# Altium project flight-controller.PrjPCB
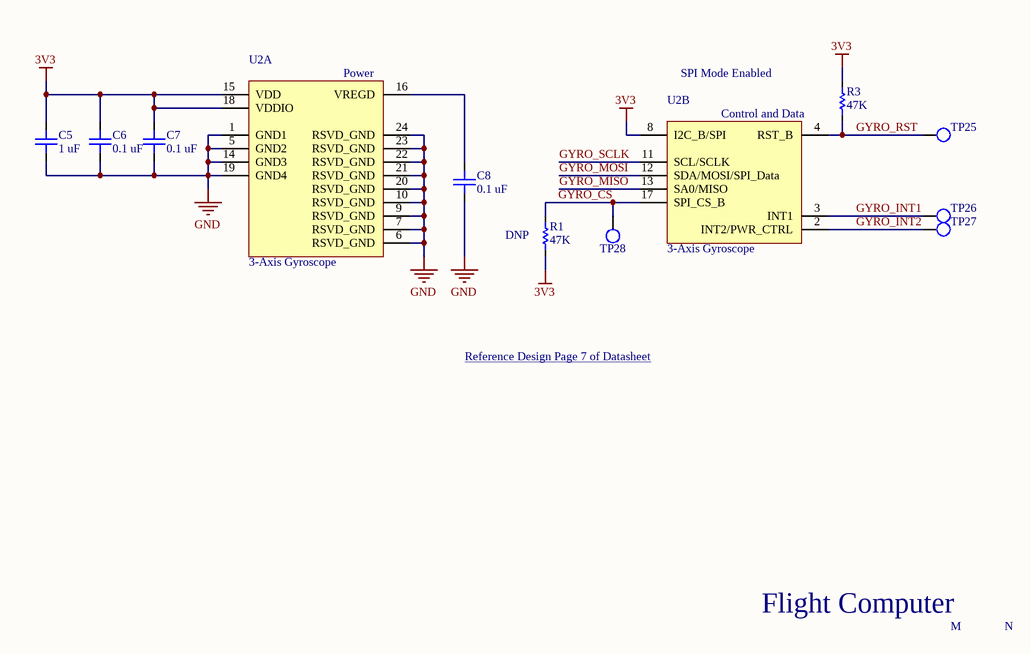
[diagram p0: gyro.SchDoc]
10 sheets, 149 parts. Net scope: global (net labels, ports and power ports of the same name join across sheets).
Board file: flight-controller.PcbDoc
Sheets:
  gyro.SchDoc
  accelerometer.SchDoc
  top_level.SchDoc
  mcu_power.SchDoc
  motor_control.SchDoc
  radio.SchDoc
  sensors.SchDoc
  programming.SchDoc
  power.SchDoc
  usb_serial.SchDoc

## Sheet gyro.SchDoc: Fault-Tolerant Quadcopter
size A; DrawnBy: Vaughn Kottler; Engineer: Vaughn Kottler; Revision: A

### Parts
C5  1 uF  [CAP-CER-0805-TALL]
C6  0.1 uF  [CAP-CER-0805-SHORT]
C7  0.1 uF  [CAP-CER-0805-SHORT]
C8  0.1 uF  [CAP-CER-0805-SHORT]
R1  47K  [RES-0805]
R3  47K  [RES-0805]
TP25  Test Point  [0603 Test Point]  (value not drawn)
TP26  Test Point  [0603 Test Point]  (value not drawn)
TP27  Test Point  [0603 Test Point]  (value not drawn)
TP28  Test Point  [0603 Test Point]  (value not drawn)
U2  3-Axis Gyroscope  [QFN24]  (parts A,B of 2)

### Nets
3V3: C5.2 C6.2 C7.2 R1.1 R3.2 U2.8(I2C_B/SPI) U2.15(VDD) U2.18(VDDIO)
GND: C5.1 C6.1 C7.1 C8.1 U2.1(GND1) U2.5(GND2) U2.6(RSVD_GND) U2.7(RSVD_GND) U2.9(RSVD_GND) U2.10(RSVD_GND) U2.14(GND3) U2.19(GND4) U2.20(RSVD_GND) U2.21(RSVD_GND) U2.22(RSVD_GND) U2.23(RSVD_GND) U2.24(RSVD_GND)
GYRO_CS: R1.2 TP28.1 U2.17(SPI_CS_B)
GYRO_INT1: TP26.1 U2.3(INT1)
GYRO_INT2: TP27.1 U2.2(INT2/PWR_CTRL)
GYRO_MISO: U2.13(SA0/MISO)
GYRO_MOSI: U2.12(SDA/MOSI/SPI_Data)
GYRO_RST: R3.1 TP25.1 U2.4(RST_B)
GYRO_SCLK: U2.11(SCL/SCLK)
NetC8_2: C8.2 U2.16(VREGD)

### Notes on the sheet
- SPI Mode Enabled
- (near R1) DNP
- Reference Design Page 7 of Datasheet <http://cache.freescale.com/files/sensors/doc/data_sheet/FXAS21002.pdf>
- Flight Computer
- M
- N
- (in symbol FXAS21002C, part A) Power
- (in symbol FXAS21002C, part B) Control and Data

### Library data of the parts
C5 = CAP-CER-1uF-10V: 10%, 0805; ComponentLink1Description: Capacitor Book (Amazon); ComponentLink1URL: https://www.amazon.com/gp/product/B0728HBDRW/
C6-C8 = CAP-CER-0.1uF-25V: 10%, 0805; ComponentLink1Description: Capacitor Book (Amazon); ComponentLink1URL: https://www.amazon.com/gp/product/B0728HBDRW/
R1 R3 = RES-47K-1/8W: 0805; ComponentLink1Description: Resistor Book (Amazon); ComponentLink1URL: https://www.amazon.com/gp/product/B071J21FYF/
TP25-TP28 = Test Point: 0603; Supplier 1: Digi-Key; Supplier Part Number 1: A106145DKR-ND
U2 = FXAS21002C: 3-Axis Digital Angular Rate Gyroscope; Supplier 1: Digi-Key; Supplier Part Number 1: FXAS21002CQR1CT-ND; ComponentLink1Description: Datasheet; ComponentLink1URL: http://cache.freescale.com/files/sensors/doc/data_sheet/FXAS21002.pdf

## Sheet accelerometer.SchDoc: Fault-Tolerant Quadcopter
size A; DrawnBy: Vaughn Kottler; Engineer: Vaughn Kottler; Revision: A
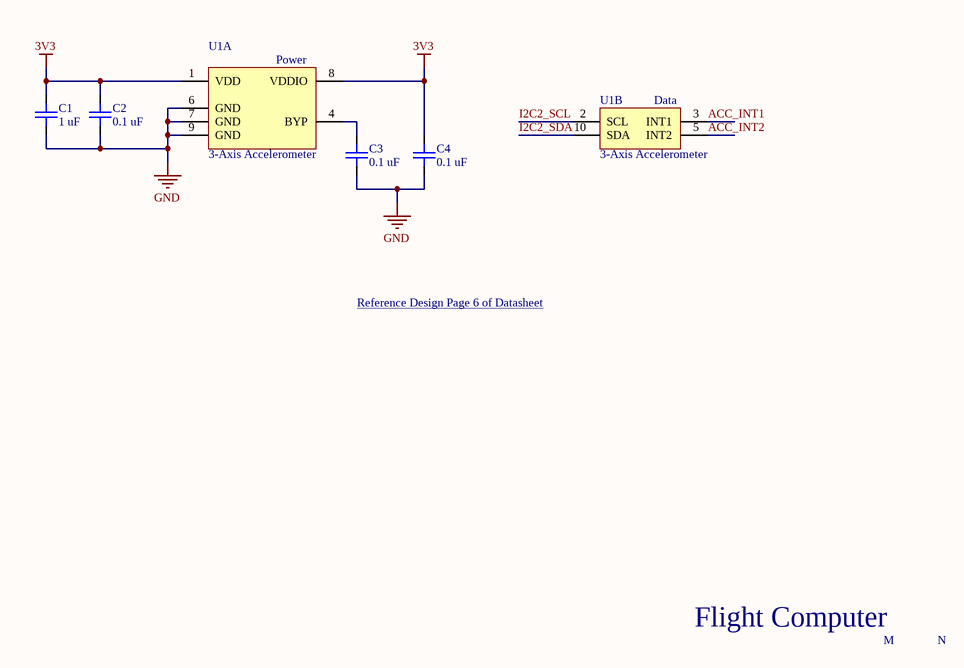
[diagram p1: accelerometer.SchDoc]

### Parts
C1  1 uF  [CAP-CER-0805-TALL]
C2  0.1 uF  [CAP-CER-0805-SHORT]
C3  0.1 uF  [CAP-CER-0805-SHORT]
C4  0.1 uF  [CAP-CER-0805-SHORT]
U1  3-Axis Accelerometer  [SON10]  (parts A,B of 2)

### Nets
3V3: C1.2 C2.2 C4.2 U1.1(VDD) U1.8(VDDIO)
GND: C1.1 C2.1 C3.1 C4.1 U1.6(GND) U1.7(GND) U1.9(GND)
ACC_INT1: U1.3(INT1)
ACC_INT2: U1.5(INT2)
I2C2_SCL: U1.2(SCL)
I2C2_SDA: U1.10(SDA)
NetC3_2: C3.2 U1.4(BYP)

### Notes on the sheet
- Reference Design Page 6 of Datasheet <https://media.digikey.com/pdf/Data%20Sheets/NXP%20PDFs/MMA8652FC.pdf>
- Flight Computer
- M
- N
- (in symbol MMA8652FC, part A) Power
- (in symbol MMA8652FC, part B) Data

### Library data of the parts
C1 = CAP-CER-1uF-10V: 10%, 0805; ComponentLink1Description: Capacitor Book (Amazon); ComponentLink1URL: https://www.amazon.com/gp/product/B0728HBDRW/
C2-C4 = CAP-CER-0.1uF-25V: 10%, 0805; ComponentLink1Description: Capacitor Book (Amazon); ComponentLink1URL: https://www.amazon.com/gp/product/B0728HBDRW/
U1 = MMA8652FC: 3-Axis, 12-bit Digital Accelerometer, I2C 400kHz; ComponentLink1Description: Datasheet; ComponentLink1URL: https://media.digikey.com/pdf/Data%20Sheets/NXP%20PDFs/MMA8652FC.pdf; Supplier 1: Digi-Key; Supplier Part Number 1: MMA8652FCR1DKR-ND

## Sheet top_level.SchDoc: Fault-Tolerant Quadcopter
size A; DrawnBy: Vaughn Kottler; Engineer: Vaughn Kottler; Revision: A
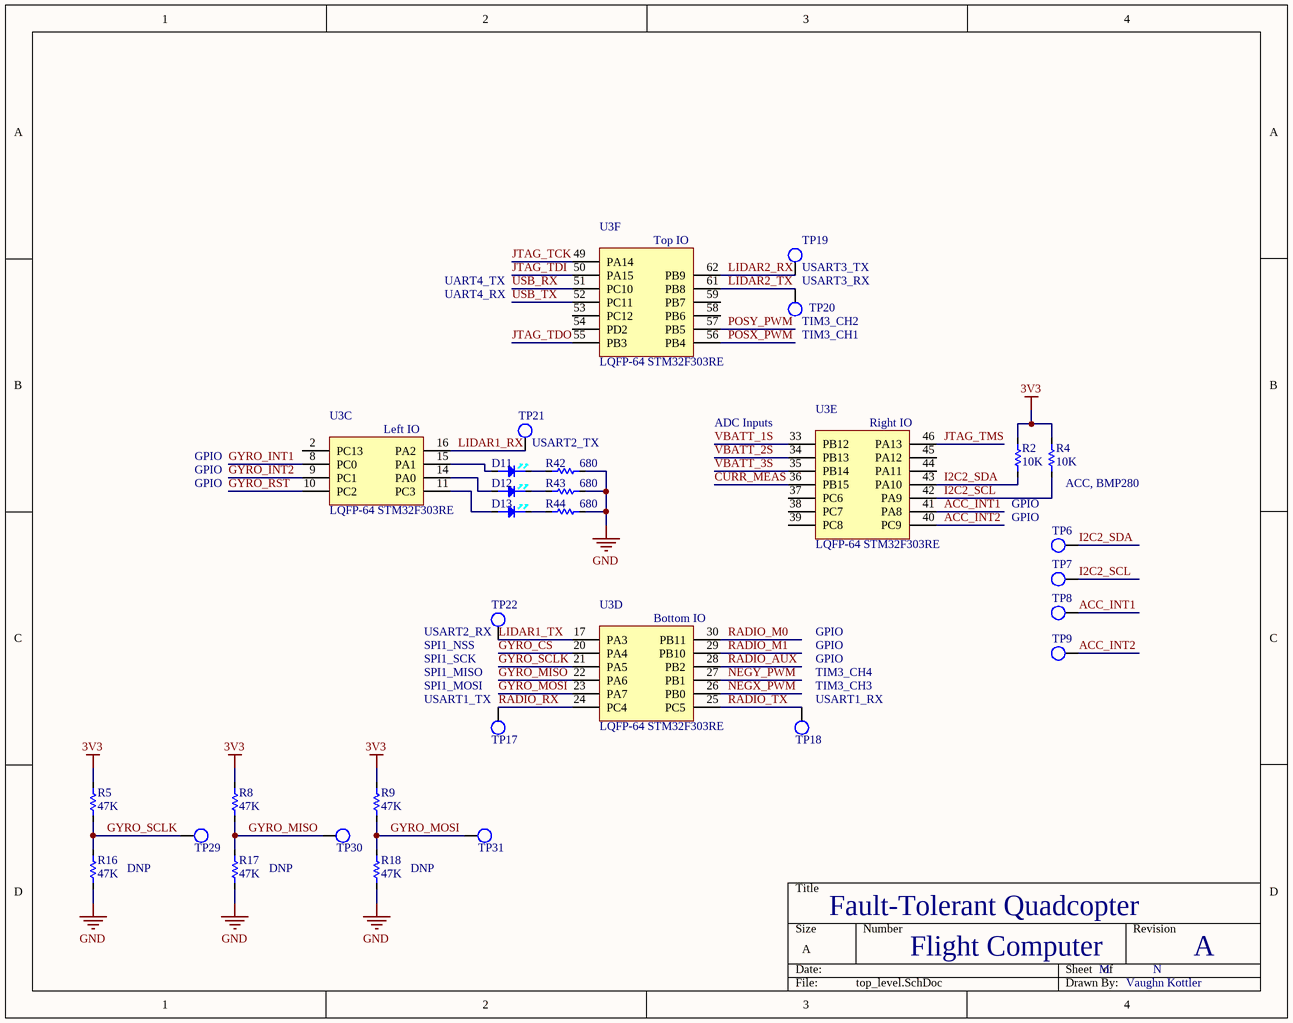
[diagram p2: top_level.SchDoc]

### Parts
D11  LED-WHT-20mA  [LED-0805]  (value not drawn)
D12  LED-WHT-20mA  [LED-0805]  (value not drawn)
D13  LED-WHT-20mA  [LED-0805]  (value not drawn)
R2  10K  [RES-0805]
R4  10K  [RES-0805]
R5  47K  [RES-0805]
R8  47K  [RES-0805]
R9  47K  [RES-0805]
R16  47K  [RES-0805]
R17  47K  [RES-0805]
R18  47K  [RES-0805]
R42  680  [RES-0805]
R43  680  [RES-0805]
R44  680  [RES-0805]
TP6  Test Point  [0603 Test Point]  (value not drawn)
TP7  Test Point  [0603 Test Point]  (value not drawn)
TP8  Test Point  [0603 Test Point]  (value not drawn)
TP9  Test Point  [0603 Test Point]  (value not drawn)
TP17  Test Point  [0603 Test Point]  (value not drawn)
TP18  Test Point  [0603 Test Point]  (value not drawn)
TP19  Test Point  [0603 Test Point]  (value not drawn)
TP20  Test Point  [0603 Test Point]  (value not drawn)
TP21  Test Point  [0603 Test Point]  (value not drawn)
TP22  Test Point  [0603 Test Point]  (value not drawn)
TP29  Test Point  [0603 Test Point]  (value not drawn)
TP30  Test Point  [0603 Test Point]  (value not drawn)
TP31  Test Point  [0603 Test Point]  (value not drawn)
U3  LQFP-64 STM32F303RE  [LQFP64]  (parts C,D,E,F of 6)

### Nets
3V3: R2.2 R4.2 R5.2 R8.2 R9.2
GND: R16.1 R17.1 R18.1 R42.2 R43.2 R44.2
ACC_INT1: TP8.1 U3.41(PA8)
ACC_INT2: TP9.1 U3.40(PC9)
CURR_MEAS: U3.36(PB15)
GYRO_CS: U3.20(PA4)
GYRO_INT1: U3.8(PC0)
GYRO_INT2: U3.9(PC1)
GYRO_MISO: R8.1 R17.2 TP30.1 U3.22(PA6)
GYRO_MOSI: R9.1 R18.2 TP31.1 U3.23(PA7)
GYRO_RST: U3.10(PC2)
GYRO_SCLK: R5.1 R16.2 TP29.1 U3.21(PA5)
I2C2_SCL: R4.1 TP7.1 U3.42(PA9)
I2C2_SDA: R2.1 TP6.1 U3.43(PA10)
JTAG_TCK: U3.49(PA14)
JTAG_TDI: U3.50(PA15)
JTAG_TDO: U3.55(PB3)
JTAG_TMS: U3.46(PA13)
LIDAR1_RX: TP21.1 U3.16(PA2)
LIDAR1_TX: TP22.1 U3.17(PA3)
LIDAR2_RX: TP19.1 U3.62(PB9)
LIDAR2_TX: TP20.1 U3.61(PB8)
NEGX_PWM: U3.26(PB0)
NEGY_PWM: U3.27(PB1)
POSX_PWM: U3.56(PB4)
POSY_PWM: U3.57(PB5)
RADIO_AUX: U3.28(PB2)
RADIO_M0: U3.30(PB11)
RADIO_M1: U3.29(PB10)
RADIO_RX: TP17.1 U3.24(PC4)
RADIO_TX: TP18.1 U3.25(PC5)
USB_RX: U3.51(PC10)
USB_TX: U3.52(PC11)
VBATT_1S: U3.33(PB12)
VBATT_2S: U3.34(PB13)
VBATT_3S: U3.35(PB14)
NetD11_1: D11.1(CT) U3.15(PA1)
NetD11_2: D11.2(AN) R42.1
NetD12_1: D12.1(CT) U3.14(PA0)
NetD12_2: D12.2(AN) R43.1
NetD13_1: D13.1(CT) U3.11(PC3)
NetD13_2: D13.2(AN) R44.1

Not connected (* = marked no-connect by the designer): U3 2(PC13) 37(PC6) 38(PC7) 39(PC8) 44(PA11) 45(PA12) 53(PC12) 54(PD2) 58(PB6) 59(PB7)

### Notes on the sheet
- UART4_TX
- UART4_RX
- USART3_RX
- (near TP19) USART3_TX
- (near TP20) TIM3_CH1
- (near TP20) TIM3_CH2
- (near U3) ADC Inputs
- GPIO
- (near TP21) USART2_TX
- (near R4) ACC, BMP280
- (near TP22) USART2_RX
- (near TP17) USART1_TX
- (near TP22) SPI1_NSS
- SPI1_SCK
- SPI1_MISO
- (near TP17) SPI1_MOSI
- (near TP18) USART1_RX
- (near TP18) TIM3_CH3
- (near TP18) TIM3_CH4
- (near R16) DNP
- (near R17) DNP
- (near R18) DNP
- Flight Computer
- M
- N
- (in symbol STM32F303RET6, part C) Left IO
- (in symbol STM32F303RET6, part D) Bottom IO
- (in symbol STM32F303RET6, part E) Right IO
- (in symbol STM32F303RET6, part F) Top IO

### Library data of the parts
D11-D13 = LED-WHT-20mA: 2.2V, 0805; ComponentLink1Description: Resistor Book (Amazon); ComponentLink1URL: https://www.amazon.com/gp/product/B071J21FYF/; Supplier 1: Digi-Key; Supplier Part Number 1: 475-1410-1-ND
R2 R4 = RES-10K-1/8W: 0805; ComponentLink1Description: Resistor Book (Amazon); ComponentLink1URL: https://www.amazon.com/gp/product/B071J21FYF/
R5 R8 R9 R16-R18 = RES-47K-1/8W: 0805; ComponentLink1Description: Resistor Book (Amazon); ComponentLink1URL: https://www.amazon.com/gp/product/B071J21FYF/
R42-R44 = RES-680-1/8W: 0805; ComponentLink1Description: Resistor Book (Amazon); ComponentLink1URL: https://www.amazon.com/gp/product/B071J21FYF/
TP6-TP9 TP17-TP22 TP29-TP31 = Test Point: 0603; Supplier 1: Digi-Key; Supplier Part Number 1: A106145DKR-ND
U3 = STM32F303RET6: ARM Cortex-M4 32-bit MCU+FPU; Supplier 1: Digi-Key; ComponentLink1Description: NUCLEO-F303RE; ComponentLink1URL: https://www.st.com/content/st_com/en/products/evaluation-tools/product-evaluation-tools/mcu-eval-tools/stm32-mcu-eval-tools/stm32-mcu-nucleo/nucleo-f303re.html; ComponentLink2Description: MBED; ComponentLink2URL: https://os.mbed.com/platforms/ST-Nucleo-F303RE/; ComponentLink3Description: Datasheet; ComponentLink3URL: https://www.st.com/content/ccc/resource/technical/document/datasheet/2c/6f/d7/64/1f/a3/4f/c9/DM00118585.pdf/files/DM00118585.pdf/jcr:content/translations/en.DM00118585.pdf; Supplier Part Number 1: 497-15163-ND; ComponentLink4Description: Reference Manual; ComponentLink4URL: https://www.st.com/content/ccc/resource/technical/document/reference_manual/4a/19/6e/18/9d/92/43/32/DM00043574.pdf/files/DM00043574.pdf/jcr:content/translations/en.DM00043574.pdf

## Sheet mcu_power.SchDoc: Fault-Tolerant Quadcopter
size A; DrawnBy: Vaughn Kottler; Engineer: Vaughn Kottler; Revision: A
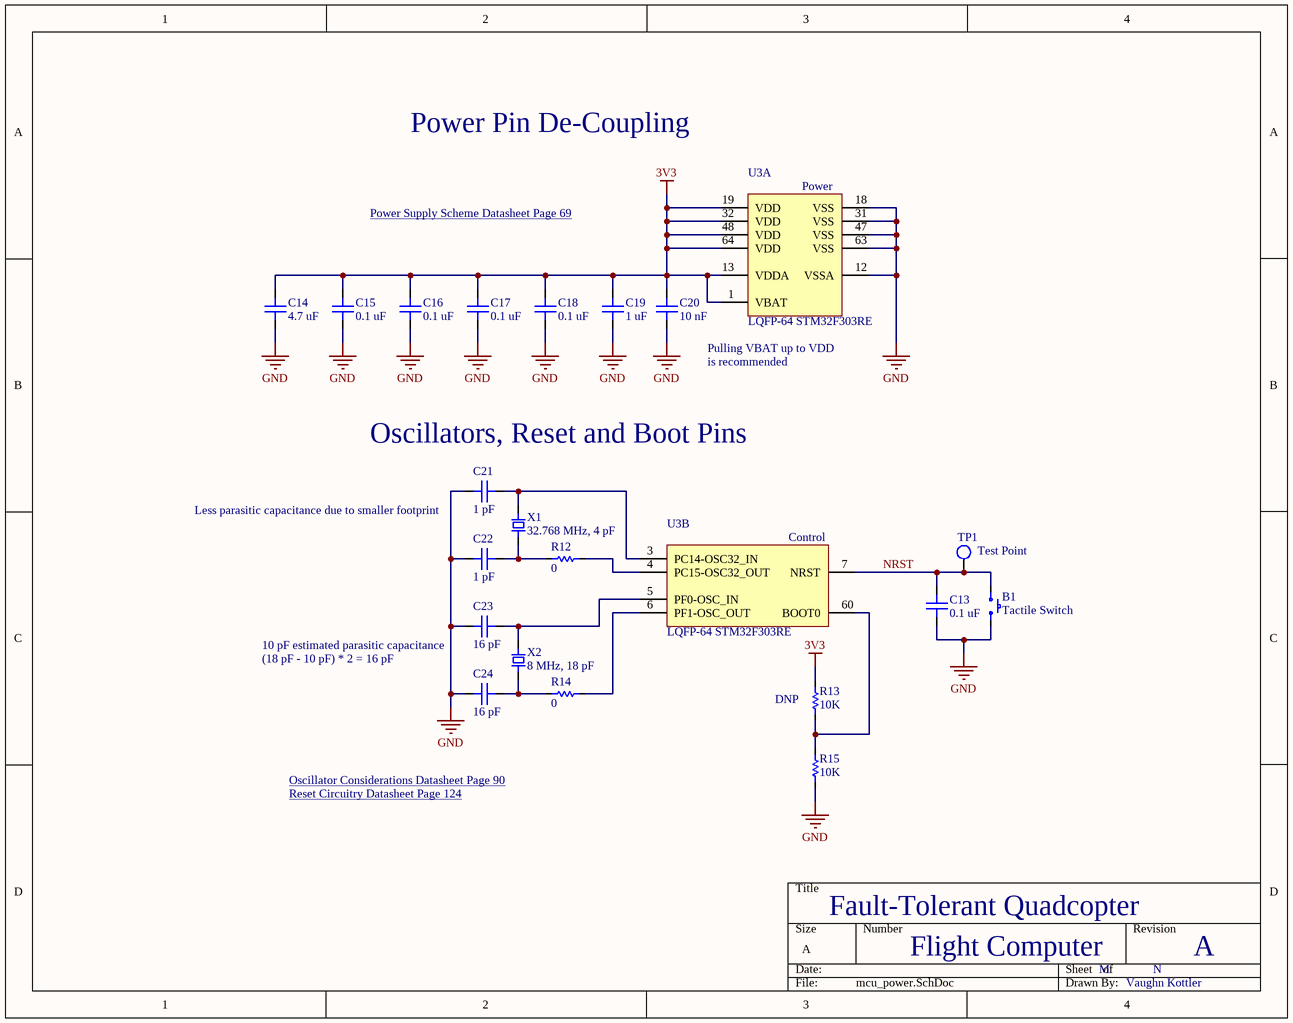
[diagram p3: mcu_power.SchDoc]

### Parts
B1  Tactile Switch  [6mm Tactile Switch]
C13  0.1 uF  [CAP-CER-0805-SHORT]
C14  4.7 uF  [CAP-CER-0805-TALL]
C15  0.1 uF  [CAP-CER-0805-SHORT]
C16  0.1 uF  [CAP-CER-0805-SHORT]
C17  0.1 uF  [CAP-CER-0805-SHORT]
C18  0.1 uF  [CAP-CER-0805-SHORT]
C19  1 uF  [CAP-CER-0805-TALL]
C20  10 nF  [CAP-CER-0805-SHORT]
C21  1 pF  [CAP-CER-0805-SHORT]
C22  1 pF  [CAP-CER-0805-SHORT]
C23  16 pF  [CAP-CER-0805-SHORT]
C24  16 pF  [CAP-CER-0805-SHORT]
R12  0  [RES-0805]
R13  10K  [RES-0805]
R14  0  [RES-0805]
R15  10K  [RES-0805]
TP1  Test Point  [0603 Test Point]
U3  LQFP-64 STM32F303RE  [LQFP64]  (parts A,B of 6)
X1  32.768 MHz, 4 pF  [XTAL-0805]
X2  8 MHz, 18 pF  [HC-49]

### Nets
3V3: C14.2 C15.2 C16.2 C17.2 C18.2 C19.2 C20.2 R13.2 U3.1(VBAT) U3.13(VDDA) U3.19(VDD) U3.32(VDD) U3.48(VDD) U3.64(VDD)
GND: B1.2 C13.1 C14.1 C15.1 C16.1 C17.1 C18.1 C19.1 C20.1 C21.1 C22.1 C23.1 C24.1 R15.1 U3.12(VSSA) U3.18(VSS) U3.31(VSS) U3.47(VSS) U3.63(VSS)
NRST: B1.1 C13.2 TP1.1 U3.7(NRST)
NetC21_2: C21.2 U3.3(PC14-OSC32_IN) X1.2
NetC22_2: C22.2 R12.1 X1.1
NetC23_2: C23.2 U3.5(PF0-OSC_IN) X2.2
NetC24_2: C24.2 R14.1 X2.1
NetR12_2: R12.2 U3.4(PC15-OSC32_OUT)
NetR13_1: R13.1 R15.2 U3.60(BOOT0)
NetR14_2: R14.2 U3.6(PF1-OSC_OUT)

### Notes on the sheet
- Power Pin De-Coupling
- Power Supply Scheme Datasheet Page 69 <https://www.st.com/content/ccc/resource/technical/document/datasheet/2c/6f/d7/64/1f/a3/4f/c9/DM00118585.pdf/files/DM00118585.pdf/jcr:content/translations/en.DM00118585.pdf>
- Pulling VBAT up to VDD
- is recommended
- Oscillators, Reset and Boot Pins
- Less parasitic capacitance due to smaller footprint
- (near C23) 10 pF estimated parasitic capacitance
- (18 pF - 10 pF) * 2 = 16 pF
- (near R13) DNP
- Oscillator Considerations Datasheet Page 90 <https://www.st.com/content/ccc/resource/technical/document/datasheet/2c/6f/d7/64/1f/a3/4f/c9/DM00118585.pdf/files/DM00118585.pdf/jcr:content/translations/en.DM00118585.pdf>
- Reset Circuitry Datasheet Page 124 <https://www.st.com/content/ccc/resource/technical/document/datasheet/2c/6f/d7/64/1f/a3/4f/c9/DM00118585.pdf/files/DM00118585.pdf/jcr:content/translations/en.DM00118585.pdf>
- Flight Computer
- M
- N
- (in symbol STM32F303RET6, part A) Power
- (in symbol STM32F303RET6, part B) Control

### Library data of the parts
B1 = Tactile Switch: NO, MOM, 6mm; Supplier 1: Digi-Key; Supplier Part Number 1: CKN9112DKR-ND
C13 C15-C18 = CAP-CER-0.1uF-25V: 10%, 0805; ComponentLink1Description: Capacitor Book (Amazon); ComponentLink1URL: https://www.amazon.com/gp/product/B0728HBDRW/
C14 = CAP-CER-4.7uF-10V: 10%, 0805; ComponentLink1Description: Capacitor Book (Amazon); ComponentLink1URL: https://www.amazon.com/gp/product/B0728HBDRW/
C19 = CAP-CER-1uF-10V: 10%, 0805; ComponentLink1Description: Capacitor Book (Amazon); ComponentLink1URL: https://www.amazon.com/gp/product/B0728HBDRW/
C20 = CAP-CER-10nF-50V: 10%, 0805; ComponentLink1Description: Capacitor Book (Amazon); ComponentLink1URL: https://www.amazon.com/gp/product/B0728HBDRW/
C21 C22 = CAP-CER-1pF-50V: ±0.25pF, 0805; ComponentLink1Description: Capacitor Book (Amazon); ComponentLink1URL: https://www.amazon.com/gp/product/B0728HBDRW/
C23 C24 = CAP-CER-16pF-50V: ±5%, 0805; ComponentLink1Description: Capacitor Book (Amazon); ComponentLink1URL: https://www.amazon.com/gp/product/B0728HBDRW/
R12 R14 = RES-0-1/8W: 0805; ComponentLink1Description: Resistor Book (Amazon); ComponentLink1URL: https://www.amazon.com/gp/product/B071J21FYF/
R13 R15 = RES-10K-1/8W: 0805; ComponentLink1Description: Resistor Book (Amazon); ComponentLink1URL: https://www.amazon.com/gp/product/B071J21FYF/
TP1 = Test Point: 0603; Supplier 1: Digi-Key; Supplier Part Number 1: A106145DKR-ND
U3 = STM32F303RET6: ARM Cortex-M4 32-bit MCU+FPU; Supplier 1: Digi-Key; ComponentLink1Description: NUCLEO-F303RE; ComponentLink1URL: https://www.st.com/content/st_com/en/products/evaluation-tools/product-evaluation-tools/mcu-eval-tools/stm32-mcu-eval-tools/stm32-mcu-nucleo/nucleo-f303re.html; ComponentLink2Description: MBED; ComponentLink2URL: https://os.mbed.com/platforms/ST-Nucleo-F303RE/; ComponentLink3Description: Datasheet; ComponentLink3URL: https://www.st.com/content/ccc/resource/technical/document/datasheet/2c/6f/d7/64/1f/a3/4f/c9/DM00118585.pdf/files/DM00118585.pdf/jcr:content/translations/en.DM00118585.pdf; Supplier Part Number 1: 497-15163-ND
X1 = XTAL-32.768kHz-4pF: Crystal, 0805; Supplier 1: Digi-Key; ComponentLink1Description: Datasheet; ComponentLink1URL: https://abracon.com/Resonators/ABS06-107-32.768kHz-T.pdf; Supplier Part Number 1: 535-12373-6-ND
X2 = XTAL-8MHz-18pF: Crystal, HC-49; Supplier 1: Digi-Key; ComponentLink1Description: Datasheet; ComponentLink1URL: https://abracon.com/Resonators/abls.pdf; Supplier Part Number 1: 535-9089-6-ND

## Sheet motor_control.SchDoc: Fault-Tolerant Quadcopter
size A; DrawnBy: Vaughn Kottler; Engineer: Vaughn Kottler; Revision: A
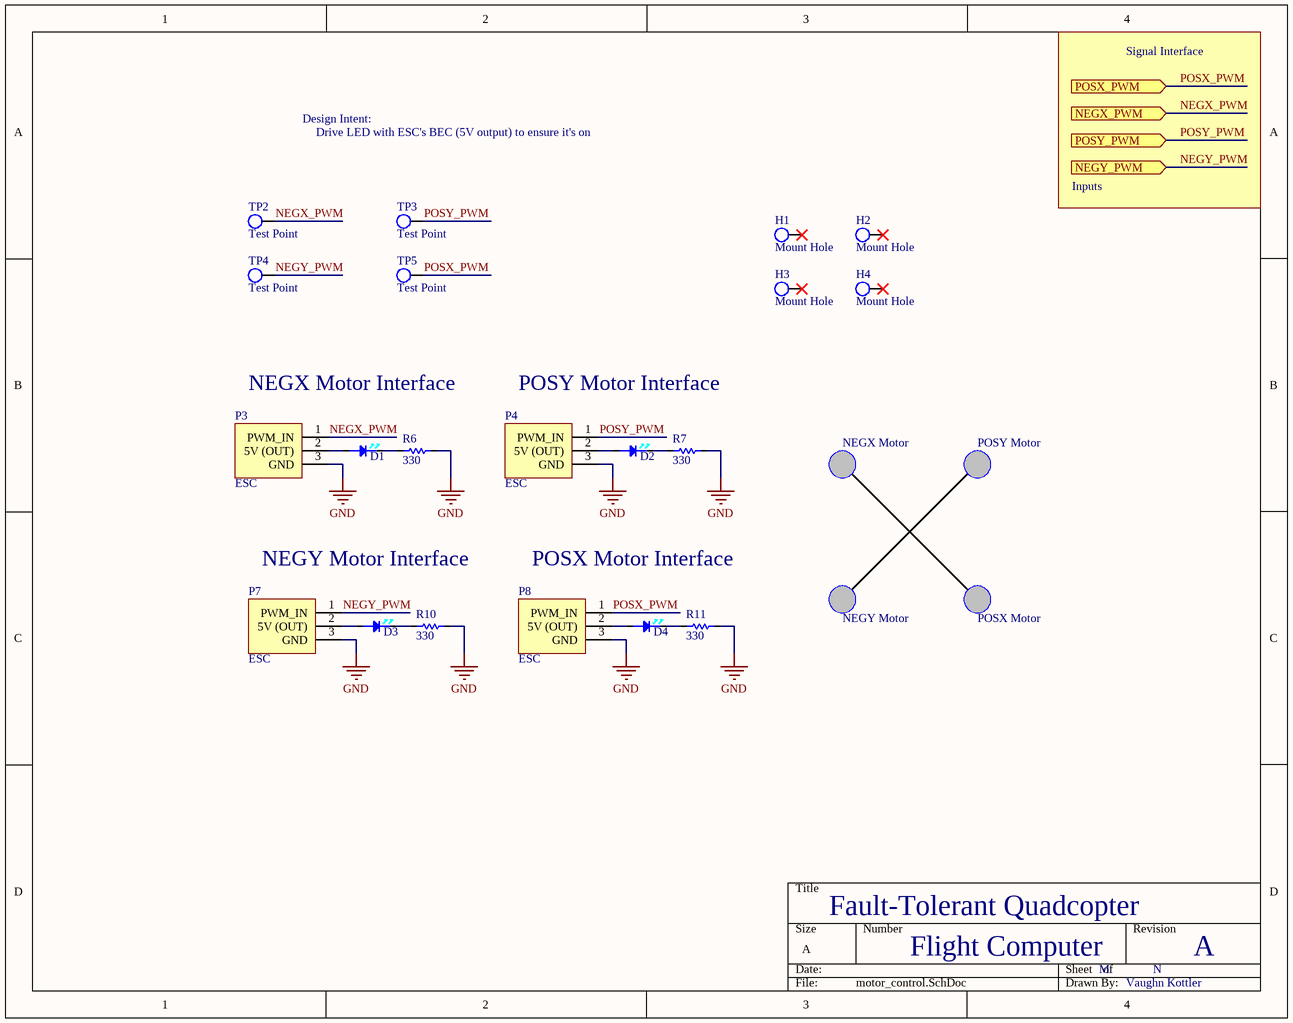
[diagram p4: motor_control.SchDoc]

### Parts
D1  LED-WHT-20mA  [LED-0805]  (value not drawn)
D2  LED-WHT-20mA  [LED-0805]  (value not drawn)
D3  LED-WHT-20mA  [LED-0805]  (value not drawn)
D4  LED-WHT-20mA  [LED-0805]  (value not drawn)
H1  Mount Hole  [4mm Mount Hole]
H2  Mount Hole  [4mm Mount Hole]
H3  Mount Hole  [4mm Mount Hole]
H4  Mount Hole  [4mm Mount Hole]
P3  ESC  [ESC RA]
P4  ESC  [ESC RA]
P7  ESC  [ESC RA]
P8  ESC  [ESC RA]
R6  330  [RES-0805]
R7  330  [RES-0805]
R10  330  [RES-0805]
R11  330  [RES-0805]
TP2  Test Point  [0603 Test Point]
TP3  Test Point  [0603 Test Point]
TP4  Test Point  [0603 Test Point]
TP5  Test Point  [0603 Test Point]

### Ports
NEGX_PWM (in), NEGY_PWM (in), POSX_PWM (in), POSY_PWM (in)

### Nets
GND: P3.3(GND) P4.3(GND) P7.3(GND) P8.3(GND) R6.2 R7.2 R10.2 R11.2
NEGX_PWM: P3.1(PWM_IN) TP2.1 ; port NEGX_PWM
NEGY_PWM: P7.1(PWM_IN) TP4.1 ; port NEGY_PWM
POSX_PWM: P8.1(PWM_IN) TP5.1 ; port POSX_PWM
POSY_PWM: P4.1(PWM_IN) TP3.1 ; port POSY_PWM
NetD1_1: D1.1(CT) P3.2(5V_(OUT))
NetD1_2: D1.2(AN) R6.1
NetD2_1: D2.1(CT) P4.2(5V_(OUT))
NetD2_2: D2.2(AN) R7.1
NetD3_1: D3.1(CT) P7.2(5V_(OUT))
NetD3_2: D3.2(AN) R10.1
NetD4_1: D4.1(CT) P8.2(5V_(OUT))
NetD4_2: D4.2(AN) R11.1

Not connected (* = marked no-connect by the designer): H1 H*; H2 H*; H3 H*; H4 H*

### Notes on the sheet
- Signal Interface
- Design Intent:
- Drive LED with ESC's BEC (5V output) to ensure it's on
- Inputs
- NEGX Motor Interface
- POSY Motor Interface
- NEGX Motor
- POSY Motor
- NEGY Motor Interface
- POSX Motor Interface
- NEGY Motor
- POSX Motor
- Flight Computer
- M
- N

### Library data of the parts
D1-D4 = LED-WHT-20mA: 2.2V, 0805; ComponentLink1Description: Resistor Book (Amazon); ComponentLink1URL: https://www.amazon.com/gp/product/B071J21FYF/; Supplier 1: Digi-Key; Supplier Part Number 1: 475-1410-1-ND
P3 P4 P7 P8 = ESC: PWM Interface, 0.1" Pitch 1x3; ComponentLink1Description: ESC + Motor Combo (Amazon); ComponentLink1URL: https://www.amazon.com/Hobbypower-1000kv-Brushless-Multicopter-Quadcopter/dp/B00E7LG85O/
R6 R7 R10 R11 = RES-330-1/8W: 0805; ComponentLink1Description: Resistor Book (Amazon); ComponentLink1URL: https://www.amazon.com/gp/product/B071J21FYF/
TP2-TP5 = Test Point: 0603; Supplier 1: Digi-Key; Supplier Part Number 1: A106145DKR-ND

## Sheet radio.SchDoc: Fault-Tolerant Quadcopter
size A; DrawnBy: Vaughn Kottler; Engineer: Vaughn Kottler; Revision: A
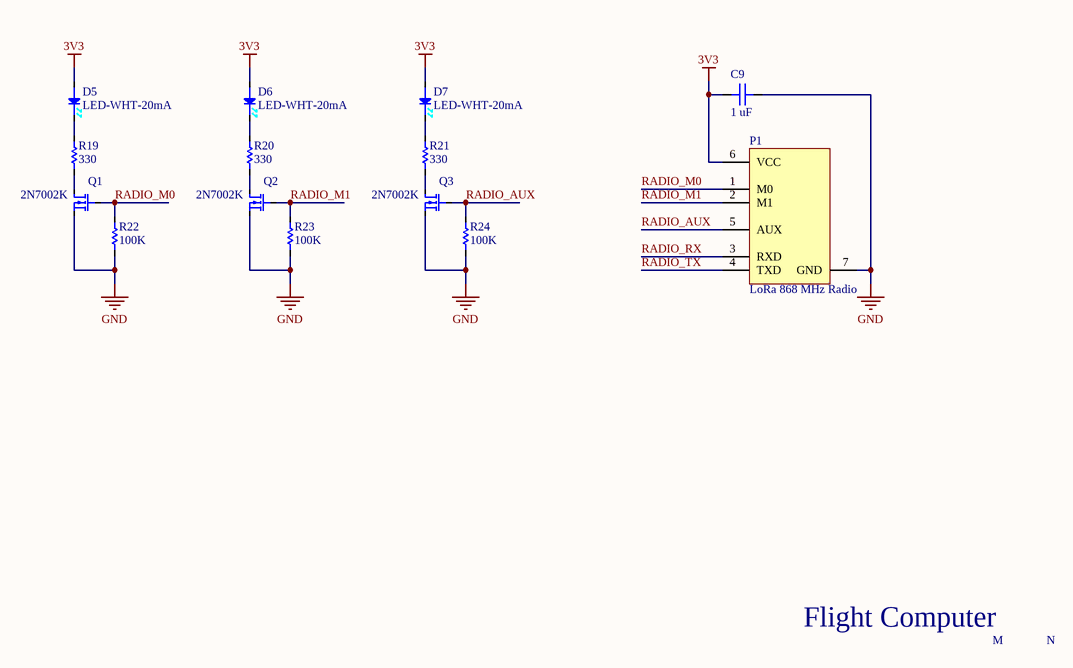
[diagram p5: radio.SchDoc]

### Parts
C9  1 uF  [CAP-CER-0805-TALL]
D5  LED-WHT-20mA  [LED-0805]
D6  LED-WHT-20mA  [LED-0805]
D7  LED-WHT-20mA  [LED-0805]
P1  LoRa 868 MHz Radio  [LoRa Breakout]
Q1  2N7002K  [SC-89]
Q2  2N7002K  [SC-89]
Q3  2N7002K  [SC-89]
R19  330  [RES-0805]
R20  330  [RES-0805]
R21  330  [RES-0805]
R22  100K  [RES-0805]
R23  100K  [RES-0805]
R24  100K  [RES-0805]

### Nets
3V3: C9.1 D5.1(CT) D6.1(CT) D7.1(CT) P1.6(VCC)
GND: C9.2 P1.7(GND) Q1.2(S) Q2.2(S) Q3.2(S) R22.1 R23.1 R24.1
RADIO_AUX: P1.5(AUX) Q3.1(G) R24.2
RADIO_M0: P1.1(M0) Q1.1(G) R22.2
RADIO_M1: P1.2(M1) Q2.1(G) R23.2
RADIO_RX: P1.3(RXD)
RADIO_TX: P1.4(TXD)
NetD5_2: D5.2(AN) R19.2
NetD6_2: D6.2(AN) R20.2
NetD7_2: D7.2(AN) R21.2
NetQ1_3: Q1.3(D) R19.1
NetQ2_3: Q2.3(D) R20.1
NetQ3_3: Q3.3(D) R21.1

### Notes on the sheet
- Flight Computer
- M
- N

### Library data of the parts
C9 = CAP-CER-1uF-10V: ±10%, 0805; ComponentLink1Description: Capacitor Book (Amazon); ComponentLink1URL: https://www.amazon.com/gp/product/B0728HBDRW/
D5-D7 = LED-WHT-20mA: 2.2V, 0805; ComponentLink1Description: Resistor Book (Amazon); ComponentLink1URL: https://www.amazon.com/gp/product/B071J21FYF/; Supplier 1: Digi-Key; Supplier Part Number 1: 475-1410-1-ND
P1 = 868 MHz SX1276 LoRa Breakout: UART Interface, 0.1" Pitch, E32 (868T20D) chipset; ComponentLink1Description: Amazon; ComponentLink1URL: https://www.amazon.com/gp/product/B07GPLJTWD/
Q1-Q3 = NMOS-2.0VT-60VDS-300mA: N-Channel, SOT-23; ComponentLink1Description: Datasheet; ComponentLink1URL: https://www.rohm.com/datasheet/RE1C002UN/re1c002untcl-e; Supplier 1: Digi-Key; Supplier Part Number 1: 2N7002K-T1-E3DKR-ND
R19-R21 = RES-330-1/8W: 0805; ComponentLink1Description: Resistor Book (Amazon); ComponentLink1URL: https://www.amazon.com/gp/product/B071J21FYF/
R22-R24 = RES-100K-1/8W: 0805; ComponentLink1Description: Resistor Book (Amazon); ComponentLink1URL: https://www.amazon.com/gp/product/B071J21FYF/

## Sheet sensors.SchDoc: Fault-Tolerant Quadcopter
size A; DrawnBy: Vaughn Kottler; Engineer: Vaughn Kottler; Revision: A
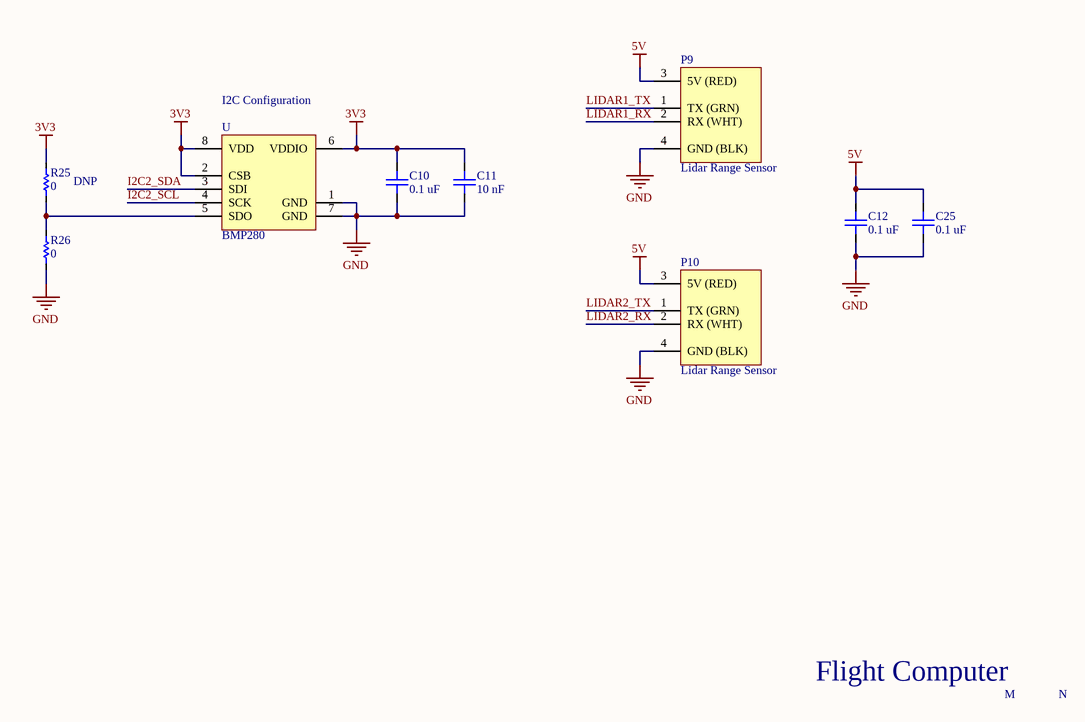
[diagram p6: sensors.SchDoc]

### Parts
C10  0.1 uF  [CAP-CER-0805-SHORT]
C11  10 nF  [CAP-CER-0805-SHORT]
C12  0.1 uF  [CAP-CER-0805-SHORT]
C25  0.1 uF  [CAP-CER-0805-SHORT]
P9  Lidar Range Sensor  [4x1 Shrouded Header 1.25mm]
P10  Lidar Range Sensor  [4x1 Shrouded Header 1.25mm]
R25  0  [RES-0805]
R26  0  [RES-0805]
U  BMP280  [LGA8]

### Nets
3V3: C10.2 C11.2 R25.2 U.2(CSB) U.6(VDDIO) U.8(VDD)
5V: C12.2 C25.2 P9.3(5V_(RED)) P10.3(5V_(RED))
GND: C10.1 C11.1 C12.1 C25.1 P9.4(GND_(BLK)) P10.4(GND_(BLK)) R26.1 U.1(GND) U.7(GND)
I2C2_SCL: U.4(SCK)
I2C2_SDA: U.3(SDI)
LIDAR1_RX: P9.2(RX_(WHT))
LIDAR1_TX: P9.1(TX_(GRN))
LIDAR2_RX: P10.2(RX_(WHT))
LIDAR2_TX: P10.1(TX_(GRN))
NetR25_1: R25.1 R26.2 U.5(SDO)

### Notes on the sheet
- (near U) I2C Configuration
- (near R25) DNP
- Flight Computer
- M
- N

### Library data of the parts
C10 C12 C25 = CAP-CER-0.1uF-25V: ±10%, 0805; ComponentLink1Description: Capacitor Book (Amazon); ComponentLink1URL: https://www.amazon.com/gp/product/B0728HBDRW/
C11 = CAP-CER-10nF-50V: ±10%, 0805; ComponentLink1Description: Capacitor Book (Amazon); ComponentLink1URL: https://www.amazon.com/gp/product/B0728HBDRW/
R25 R26 = RES-0-1/8W: 0805; ComponentLink1Description: Resistor Book (Amazon); ComponentLink1URL: https://www.amazon.com/gp/product/B071J21FYF/
U = BMP280: Digital Pressure Sensor; Supplier 1: Digi-Key; Supplier Part Number 1: 828-1064-6-ND; ComponentLink1Description: Datasheet; ComponentLink1URL: https://ae-bst.resource.bosch.com/media/_tech/media/datasheets/BST-BMP280-DS001-19.pdf
P9 P10 = Lidar Range Sensor: ComponentLink1Description: Amazon; ComponentLink1URL: https://www.amazon.com/gp/product/B075V5TZRY/; Supplier 1: Digi-Key; Supplier Part Number 1: H2201-ND

## Sheet programming.SchDoc: Fault-Tolerant Quadcopter
size A; DrawnBy: Vaughn Kottler; Engineer: Vaughn Kottler; Revision: A
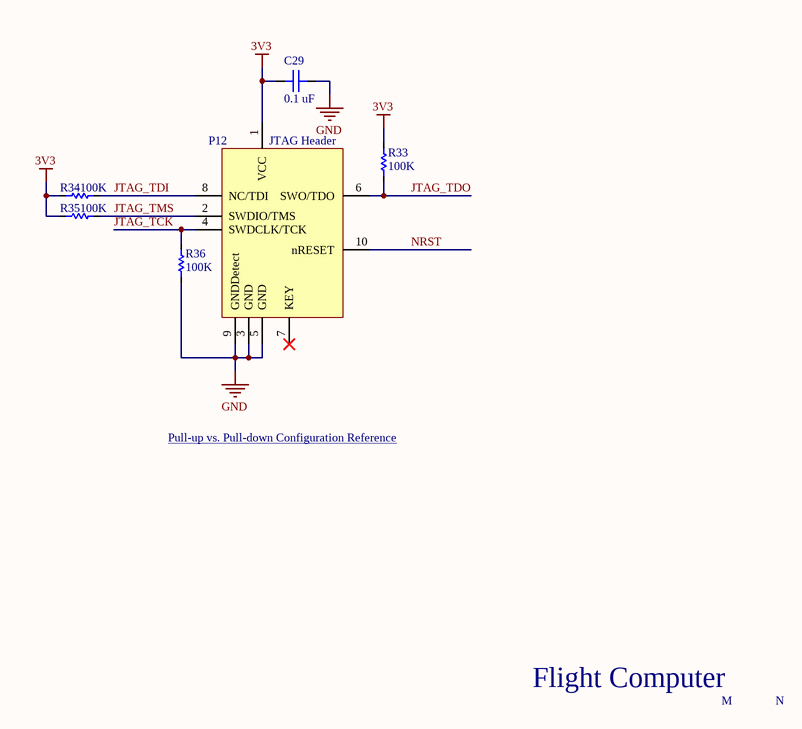
[diagram p7: programming.SchDoc]

### Parts
C29  0.1 uF  [CAP-CER-0805-SHORT]
P12  JTAG Header  [SMD Header 5x2x1.27mm]
R33  100K  [RES-0805]
R34  100K  [RES-0805]
R35  100K  [RES-0805]
R36  100K  [RES-0805]

### Nets
3V3: C29.1 P12.1(VCC) R33.2 R34.2 R35.2
GND: C29.2 P12.3(GND) P12.5(GND) P12.9(GNDDetect) R36.1
JTAG_TCK: P12.4(SWDCLK/TCK) R36.2
JTAG_TDI: P12.8(NC/TDI) R34.1
JTAG_TDO: P12.6(SWO/TDO) R33.1
JTAG_TMS: P12.2(SWDIO/TMS) R35.1
NRST: P12.10(nRESET)

Not connected (* = marked no-connect by the designer): P12 7(KEY)*

### Notes on the sheet
- Pull-up vs. Pull-down Configuration Reference <http://support.code-red-tech.com/CodeRedWiki/HardwareDebugConnections>
- Flight Computer
- M
- N

### Library data of the parts
C29 = CAP-CER-0.1uF-25V: ±10%, 0805; ComponentLink1Description: Capacitor Book (Amazon); ComponentLink1URL: https://www.amazon.com/gp/product/B0728HBDRW/
P12 = 10-pin JTAG Header: Supplier 1: Arrow; Supplier Part Number 1: 3220-10-0300-00; ComponentLink1Description: Pinout; ComponentLink1URL: http://infocenter.arm.com/help/topic/com.arm.doc.faqs/attached/13634/cortex_debug_connectors.pdf
R33-R36 = RES-100K-1/8W: 0805; ComponentLink1Description: Resistor Book (Amazon); ComponentLink1URL: https://www.amazon.com/gp/product/B071J21FYF/

## Sheet power.SchDoc: Fault-Tolerant Quadcopter
size A; DrawnBy: Vaughn Kottler; Engineer: Vaughn Kottler; Revision: A
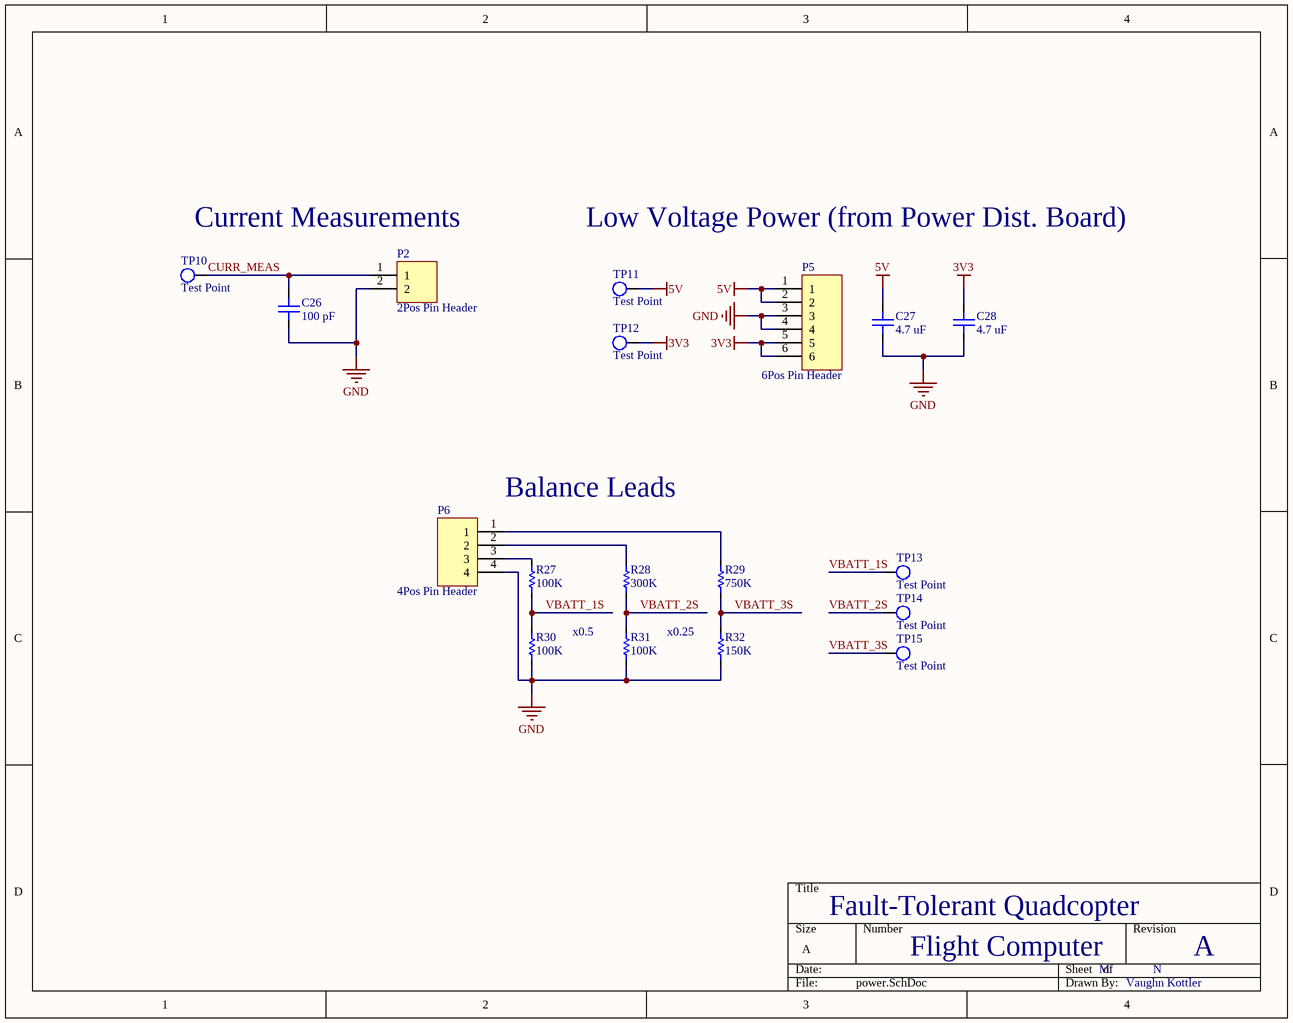
[diagram p8: power.SchDoc]

### Parts
C26  100 pF  [CAP-CER-0805-SHORT]
C27  4.7 uF  [CAP-CER-0805-TALL]
C28  4.7 uF  [CAP-CER-0805-TALL]
P2  2Pos Pin Header  [2Pos Pin Header JST]
P5  6Pos Pin Header  [6Pos Pin Header JST]
P6  4Pos Pin Header  [4Pos Pin Header JST]
R27  100K  [RES-0805]
R28  300K  [RES-0805]
R29  750K  [RES-0805]
R30  100K  [RES-0805]
R31  100K  [RES-0805]
R32  150K  [RES-0805]
TP10  Test Point  [0603 Test Point]
TP11  Test Point  [0603 Test Point]
TP12  Test Point  [0603 Test Point]
TP13  Test Point  [0603 Test Point]
TP14  Test Point  [0603 Test Point]
TP15  Test Point  [0603 Test Point]

### Nets
3V3: C28.2 P5.5 P5.6 TP12.1
5V: C27.2 P5.1 P5.2 TP11.1
GND: C26.1 C27.1 C28.1 P2.2 P5.3 P5.4 P6.4 R30.1 R31.1 R32.1
CURR_MEAS: C26.2 P2.1 TP10.1
VBATT_1S: R27.1 R30.2 TP13.1
VBATT_2S: R28.1 R31.2 TP14.1
VBATT_3S: R29.1 R32.2 TP15.1
NetP6_1: P6.1 R29.2
NetP6_2: P6.2 R28.2
NetP6_3: P6.3 R27.2

### Notes on the sheet
- Current Measurements
- Low Voltage Power (from Power Dist. Board)
- Balance Leads
- x0.5
- (near R32) x0.25
- Flight Computer
- M
- N

### Library data of the parts
C26 = CAP-CER-100pF-50V: ±0.25pF, 0805; ComponentLink1Description: Capacitor Book (Amazon); ComponentLink1URL: https://www.amazon.com/gp/product/B0728HBDRW/
C27 C28 = CAP-CER-4.7uF-10V: ±10%, 0805; ComponentLink1Description: Capacitor Book (Amazon); ComponentLink1URL: https://www.amazon.com/gp/product/B0728HBDRW/
P2 = 2Pos Pin Header: 0.1" Pitch 1x2
P5 = 6Pos Pin Header: 0.1" Pitch 1x6
P6 = 4Pos Pin Header: 0.1" Pitch 1x4
R27 R30 R31 = RES-100K-1/8W: 0805; ComponentLink1Description: Resistor Book (Amazon); ComponentLink1URL: https://www.amazon.com/gp/product/B071J21FYF/
R28 = RES-300K-1/8W: 0805; ComponentLink1Description: Resistor Book (Amazon); ComponentLink1URL: https://www.amazon.com/gp/product/B071J21FYF/
R29 = RES-750K-1/8W: 0805; ComponentLink1Description: Resistor Book (Amazon); ComponentLink1URL: https://www.amazon.com/gp/product/B071J21FYF/
R32 = RES-150K-1/8W: 0805; ComponentLink1Description: Resistor Book (Amazon); ComponentLink1URL: https://www.amazon.com/gp/product/B071J21FYF/
TP10-TP15 = Test Point: 0603; Supplier 1: Digi-Key; Supplier Part Number 1: A106145DKR-ND

## Sheet usb_serial.SchDoc: Fault-Tolerant Quadcopter
size A; DrawnBy: Vaughn Kottler; Engineer: Vaughn Kottler; Revision: A
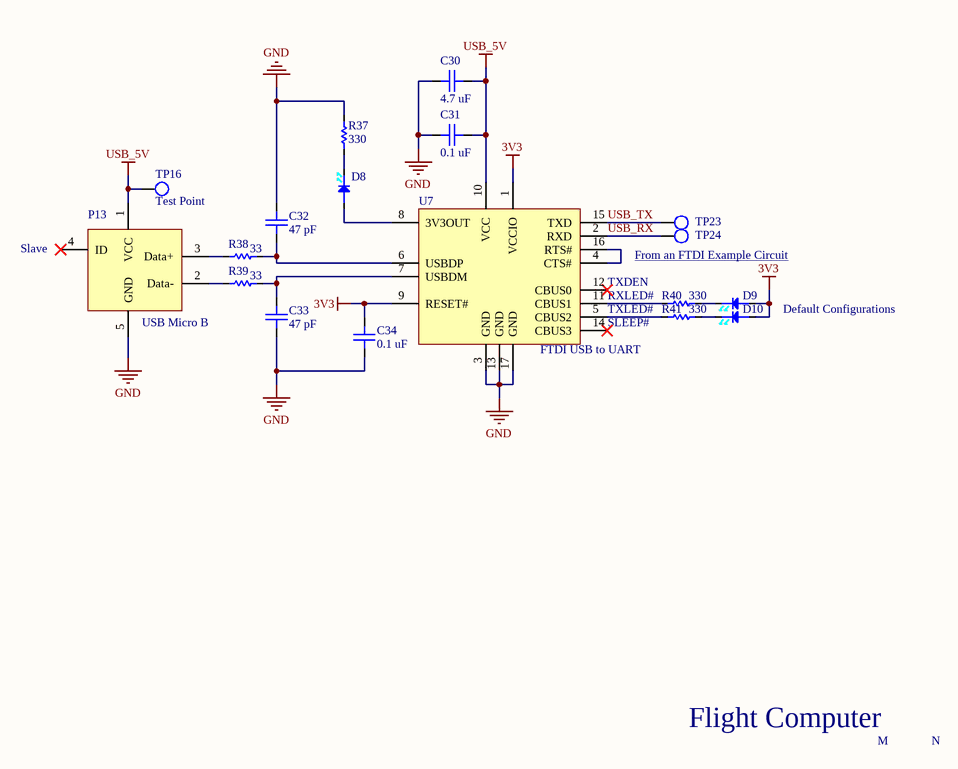
[diagram p9: usb_serial.SchDoc]

### Parts
C30  4.7 uF  [CAP-CER-0805-TALL]
C31  0.1 uF  [CAP-CER-0805-SHORT]
C32  47 pF  [CAP-CER-0805-SHORT]
C33  47 pF  [CAP-CER-0805-SHORT]
C34  0.1 uF  [CAP-CER-0805-SHORT]
D8  LED-WHT-20mA  [LED-0805]  (value not drawn)
D9  LED-WHT-20mA  [LED-0805]  (value not drawn)
D10  LED-WHT-20mA  [LED-0805]  (value not drawn)
P13  USB Micro B  [USB Micro B]
R37  330  [RES-0805]
R38  33  [RES-0805]
R39  33  [RES-0805]
R40  330  [RES-0805]
R41  330  [RES-0805]
TP16  Test Point  [0603 Test Point]
TP23  Test Point  [0603 Test Point]  (value not drawn)
TP24  Test Point  [0603 Test Point]  (value not drawn)
U7  FTDI USB to UART  [QFN16-0.65]

### Nets
3V3: C34.2 D9.1(CT) D10.1(CT) U7.1(VCCIO) U7.9(RESET#)
GND: C30.2 C31.2 C32.2 C33.1 C34.1 P13.5(GND) R37.1 U7.3(GND) U7.13(GND) U7.17(GND)
USB_5V: C30.1 C31.1 P13.1(VCC) TP16.1 U7.10(VCC)
USB_RX: TP24.1 U7.2(RXD)
USB_TX: TP23.1 U7.15(TXD)
NetC32_1: C32.1 R38.2 U7.6(USBDP)
NetC33_2: C33.2 R39.2 U7.7(USBDM)
NetD8_1: D8.1(CT) U7.8(3V3OUT)
NetD8_2: D8.2(AN) R37.2
NetD9_2: D9.2(AN) R40.2
NetD10_2: D10.2(AN) R41.2
NetP13_2: P13.2(Data-) R39.1
NetP13_3: P13.3(Data+) R38.1
NetR40_1: R40.1 U7.11(CBUS1)
NetR41_1: R41.1 U7.5(CBUS2)
NetU7_4: U7.4(CTS#) U7.16(RTS#)

Not connected (* = marked no-connect by the designer): P13 4(ID)*; U7 12(CBUS0)* 14(CBUS3)*

### Notes on the sheet
- (near P13) Slave
- (near TP24) From an FTDI Example Circuit <https://www.ftdichip.com/Support/Documents/AppNotes/AN_216_Using_the_FT230X_to_design_a_GPS_Dongle.pdf>
- TXDEN
- RXLED#
- TXLED#
- SLEEP#
- Default Configurations
- Flight Computer
- M
- N

### Library data of the parts
C30 = CAP-CER-4.7uF-10V: ±10%, 0805; ComponentLink1Description: Capacitor Book (Amazon); ComponentLink1URL: https://www.amazon.com/gp/product/B0728HBDRW/
C31 C34 = CAP-CER-0.1uF-25V: ±10%, 0805; ComponentLink1Description: Capacitor Book (Amazon); ComponentLink1URL: https://www.amazon.com/gp/product/B0728HBDRW/
C32 C33 = CAP-CER-47pF-50V: ±5%, 0805; ComponentLink1Description: Capacitor Book (Amazon); ComponentLink1URL: https://www.amazon.com/gp/product/B0728HBDRW/
D8-D10 = LED-WHT-20mA: 2.2V, 0805; ComponentLink1Description: Resistor Book (Amazon); ComponentLink1URL: https://www.amazon.com/gp/product/B071J21FYF/; Supplier 1: Digi-Key; Supplier Part Number 1: 475-1410-1-ND
R37 R40 R41 = RES-330-1/8W: 0805; ComponentLink1Description: Resistor Book (Amazon); ComponentLink1URL: https://www.amazon.com/gp/product/B071J21FYF/
R38 R39 = RES-33-1/8W: 0805; ComponentLink1Description: Resistor Book (Amazon); ComponentLink1URL: https://www.amazon.com/gp/product/B071J21FYF/
TP16 TP23 TP24 = Test Point: 0603; Supplier 1: Digi-Key; Supplier Part Number 1: A106145DKR-ND
U7 = FT230XQ-R: Supplier 1: Digi-Key; Supplier Part Number 1: 768-1130-6-ND; ComponentLink1Description: Datasheet; ComponentLink1URL: https://www.ftdichip.com/Support/Documents/DataSheets/ICs/DS_FT230X.pdf
P13 = USB Micro B: Supplier 1: Digi-Key; Supplier Part Number 1: 609-4616-6-ND; ComponentLink1Description: Pinout; ComponentLink1URL: http://pinouts.ru/PortableDevices/micro_usb_pinout.shtml

## Nets that join several sheets
3V3: gyro (8 pins), accelerometer (5 pins), top_level (5 pins), mcu_power (14 pins), radio (5 pins), sensors (6 pins), programming (5 pins), power (C28.2 P5.5 P5.6 TP12.1), usb_serial (5 pins)
5V: sensors (C12.2 C25.2 P9.3 P10.3), power (C27.2 P5.1 P5.2 TP11.1)
GND: gyro (17 pins), accelerometer (7 pins), top_level (6 pins), mcu_power (19 pins), motor_control (8 pins), radio (8 pins), sensors (9 pins), programming (5 pins), power (10 pins), usb_serial (10 pins)
ACC_INT1: accelerometer (U1.3), top_level (TP8.1 U3.41)
ACC_INT2: accelerometer (U1.5), top_level (TP9.1 U3.40)
CURR_MEAS: top_level (U3.36), power (C26.2 P2.1 TP10.1)
GYRO_CS: gyro (R1.2 TP28.1 U2.17), top_level (U3.20)
GYRO_INT1: gyro (TP26.1 U2.3), top_level (U3.8)
GYRO_INT2: gyro (TP27.1 U2.2), top_level (U3.9)
GYRO_MISO: gyro (U2.13), top_level (R8.1 R17.2 TP30.1 U3.22)
GYRO_MOSI: gyro (U2.12), top_level (R9.1 R18.2 TP31.1 U3.23)
GYRO_RST: gyro (R3.1 TP25.1 U2.4), top_level (U3.10)
GYRO_SCLK: gyro (U2.11), top_level (R5.1 R16.2 TP29.1 U3.21)
I2C2_SCL: accelerometer (U1.2), top_level (R4.1 TP7.1 U3.42), sensors (U.4)
I2C2_SDA: accelerometer (U1.10), top_level (R2.1 TP6.1 U3.43), sensors (U.3)
JTAG_TCK: top_level (U3.49), programming (P12.4 R36.2)
JTAG_TDI: top_level (U3.50), programming (P12.8 R34.1)
JTAG_TDO: top_level (U3.55), programming (P12.6 R33.1)
JTAG_TMS: top_level (U3.46), programming (P12.2 R35.1)
LIDAR1_RX: top_level (TP21.1 U3.16), sensors (P9.2)
LIDAR1_TX: top_level (TP22.1 U3.17), sensors (P9.1)
LIDAR2_RX: top_level (TP19.1 U3.62), sensors (P10.2)
LIDAR2_TX: top_level (TP20.1 U3.61), sensors (P10.1)
NEGX_PWM: top_level (U3.26), motor_control (P3.1 TP2.1)
NEGY_PWM: top_level (U3.27), motor_control (P7.1 TP4.1)
NRST: mcu_power (B1.1 C13.2 TP1.1 U3.7), programming (P12.10)
POSX_PWM: top_level (U3.56), motor_control (P8.1 TP5.1)
POSY_PWM: top_level (U3.57), motor_control (P4.1 TP3.1)
RADIO_AUX: top_level (U3.28), radio (P1.5 Q3.1 R24.2)
RADIO_M0: top_level (U3.30), radio (P1.1 Q1.1 R22.2)
RADIO_M1: top_level (U3.29), radio (P1.2 Q2.1 R23.2)
RADIO_RX: top_level (TP17.1 U3.24), radio (P1.3)
RADIO_TX: top_level (TP18.1 U3.25), radio (P1.4)
USB_RX: top_level (U3.51), usb_serial (TP24.1 U7.2)
USB_TX: top_level (U3.52), usb_serial (TP23.1 U7.15)
VBATT_1S: top_level (U3.33), power (R27.1 R30.2 TP13.1)
VBATT_2S: top_level (U3.34), power (R28.1 R31.2 TP14.1)
VBATT_3S: top_level (U3.35), power (R29.1 R32.2 TP15.1)